# EAGLE design supply_switch (EAGLE 7.1.0)
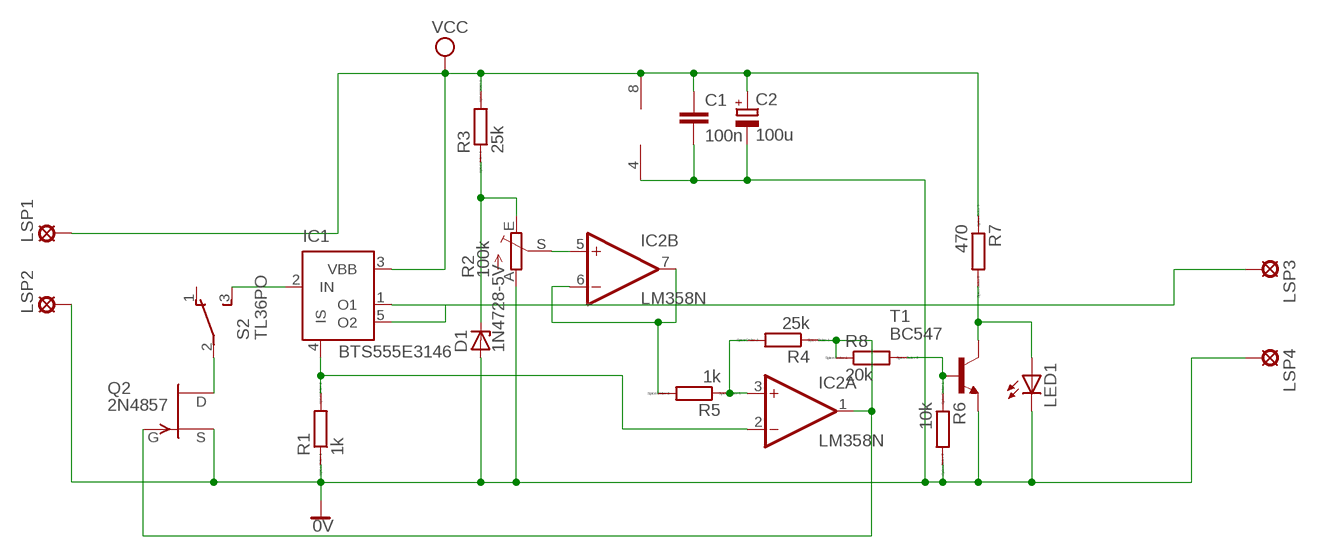
[diagram p0: schematic, sheet 1]

## Parts
C1  100n  C-EU025-030X050  [C025-030X050]
C2  100u  CPOL-EUE3.5-10  [E3,5-10]
D1  1N4728-5V  1N4728  [DO41Z10]
IC1  BTS555E3146  [TO220-52]
IC2  LM358N  [DIL08]
LED1  LED5MM  [LED5MM]
LSP1  SE14  [SE14]
LSP2  SE14  [SE14]
LSP3  SE14  [SE14]
LSP4  SE14  [SE14]
Q2  2N4857  [TO18]
R1  1k  R-EU_0207_15  [0207/15]
R2  100k  TRIM_EU-CA6H  [CA6H]
R3  25k  R-EU_0207_15  [0207/15]
R4  25k  R-EU_0207_15  [0207/15]
R5  1k  R-EU_0207_15  [0207/15]
R6  10k  R-EU_0207_15  [0207/15]
R7  470  R-EU_0207_15  [0207/15]
R8  20k  R-EU_0207_15  [0207/15]
S2  TL36PO  [TL3XPO]
T1  BC547  [TO92]

## Nets
0V: C1.2 C2.- D1.A IC2.4(P:V-) LED1.K(C) LSP2.MP LSP4.MP Q2.1(S) R1.1 R2.A R6.2 T1.1(E)
N$1: IC1.1(O1) IC1.5(O2) LSP3.MP
N$2: Q2.2(D) S2.2(P)
N$3: IC1.2(IN) S2.3(S)
N$4: IC2.6(B:-IN) IC2.7(B:OUT) R5.2
N$5: IC2.5(B:+IN) R2.S
N$6: D1.C R2.E R3.1
N$7: R6.1 R8.2 T1.2(B)
N$9: IC2.3(A:+IN) R4.2 R5.1
N$10: IC2.1(A:OUT) Q2.3(G) R4.1 R8.1
N$11: IC1.4(IS) IC2.2(A:-IN) R1.2
N$13: LED1.A R7.2 T1.3(C)
VCC: C1.1 C2.+ IC1.3(VBB) IC2.8(P:V+) LSP1.MP R3.2 R7.1
Unconnected: S2.1(O)

## Library data of the parts
C1 = rcl:C-EU: CAPACITOR, European symbol
C2 = rcl:CPOL-EU: POLARIZED CAPACITOR, European symbol
D1 = diode:1N4728: Z DIODE 3.3 V, 1W, 5 percent
IC1 = infineon:BTS555: PROFET® Data Sheet BTS555 Source: http://www.infineon.com/upload/Document/cmc_upload/documents/011/8726/Datasheet_BTS555.pdf; OC_FARNELL: unknown; OC_NEWARK: unknown
IC2 = linear:LM358: OP AMP also LM158; LM258; LM2904 Source: http://cache.national.com/ds/LM/LM158.pdf
LED1 = led:LED: LED OSRAM: - CHIPLED LG R971, LG N971, LY N971, LG Q971, LY Q971, LO R971, LY R971 LH N974, LH R974 LS Q976, LO Q976, LY Q976 LO Q996 - Hyper CHIPLED LW Q18S LB Q993, LB Q99A, LB R99A - SideLED LS A670, LO A670, LY A670, LG A670, LP A670 LB A673, LV A673, LT A673, LW A673 LH A674 LY A675 LS A676, LA A676, LO A676, LY A676, LW A676 LS A679, LY A679, LG A679 - Hyper Micro SIDELED® LS Y876, LA Y876, LO Y876, LY Y876 LT Y87S - SmartLED LW L88C, LW L88S LB L89C, LB L89S, LG L890 LS L89K, LO L89K, LY L89K LS L896, LA L896, LO L896, LY L896 - TOPLED LS T670, LO T670, LY T670, LG T670, LP T670 LSG T670, LSP T670, LSY T670, LOP T670, LYG T670 LG T671, LOG T671, LSG T671 LB T673, LV T673, LT T673, LW T673 LH T674 LS T676, LA T676, LO T676, LY T676, LB T676, LH T676, LSB T676, LW T676 LB T67C, LV T67C, LT T67C, LS T67K, LO T67K, LY T67K, LW E67C LS E67B, LA E67B, LO E67B, LY E67B, LB E67C, LV E67C, LT E67C LW T67C LS T679, LY T679, LG T679 LS T770, LO T770, LY T770, LG T770, LP T770 LB T773, LV T773, LT T773, LW T773 LH T774 LS E675, LA E675, LY E675, LS T675 LS T776, LA T776, LO T776, LY T776, LB T776 LHGB T686 LT T68C, LB T68C - Hyper Mini TOPLED® LB M676 - Mini TOPLED Santana® LG M470 LS M47K, LO M47K, LY M47K Source: http://www.osram.convergy.de LUXEON: - LUMILED® LXK2-PW12-R00, LXK2-PW12-S00, LXK2-PW14-U00, LXK2-PW14-V00 LXK2-PM12-R00, LXK2-PM12-S00, LXK2-PM14-U00 LXK2-PE12-Q00, LXK2-PE12-R00, LXK2-PE12-S00, LXK2-PE14-T00, LXK2-PE14-U00 LXK2-PB12-K00, LXK2-PB12-L00, LXK2-PB12-M00, LXK2-PB14-N00, LXK2-PB14-P00, LXK2-PB14-Q00 LXK2-PR12-L00, LXK2-PR12-M00, LXK2-PR14-Q00, LXK2-PR14-R00 LXK2-PD12-Q00, LXK2-PD12-R00, LXK2-PD12-S00 LXK2-PH12-R00, LXK2-PH12-S00 LXK2-PL12-P00, LXK2-PL12-Q00, LXK2-PL12-R00 Source: www.luxeon.com KINGBRIGHT: KA-3528ASYC Source: www.kingbright.com
LSP1-LSP4 = solpad:SE14: SOLDER PAD E1553, drill 1,4mm, distributor Buerklin, 07F820
Q2 = transistor-fet:2N4857: N-Channel Junction FET
R1 R3-R8 = resistor:R-EU_: RESISTOR, European symbol; SPICEPREFIX: R
R2 = pot:TRIM_EU-: POTENTIOMETER
S2 = switch:TL36PO: TINY SWITCH ON - ON Source: http://www2.produktinfo.conrad.com/datenblaetter/700000-724999/705152-da-01-de-Subminiaturschalter_TL_36YO.pdf
T1 = transistor:BC547: NPN TRANSISTOR

## Board
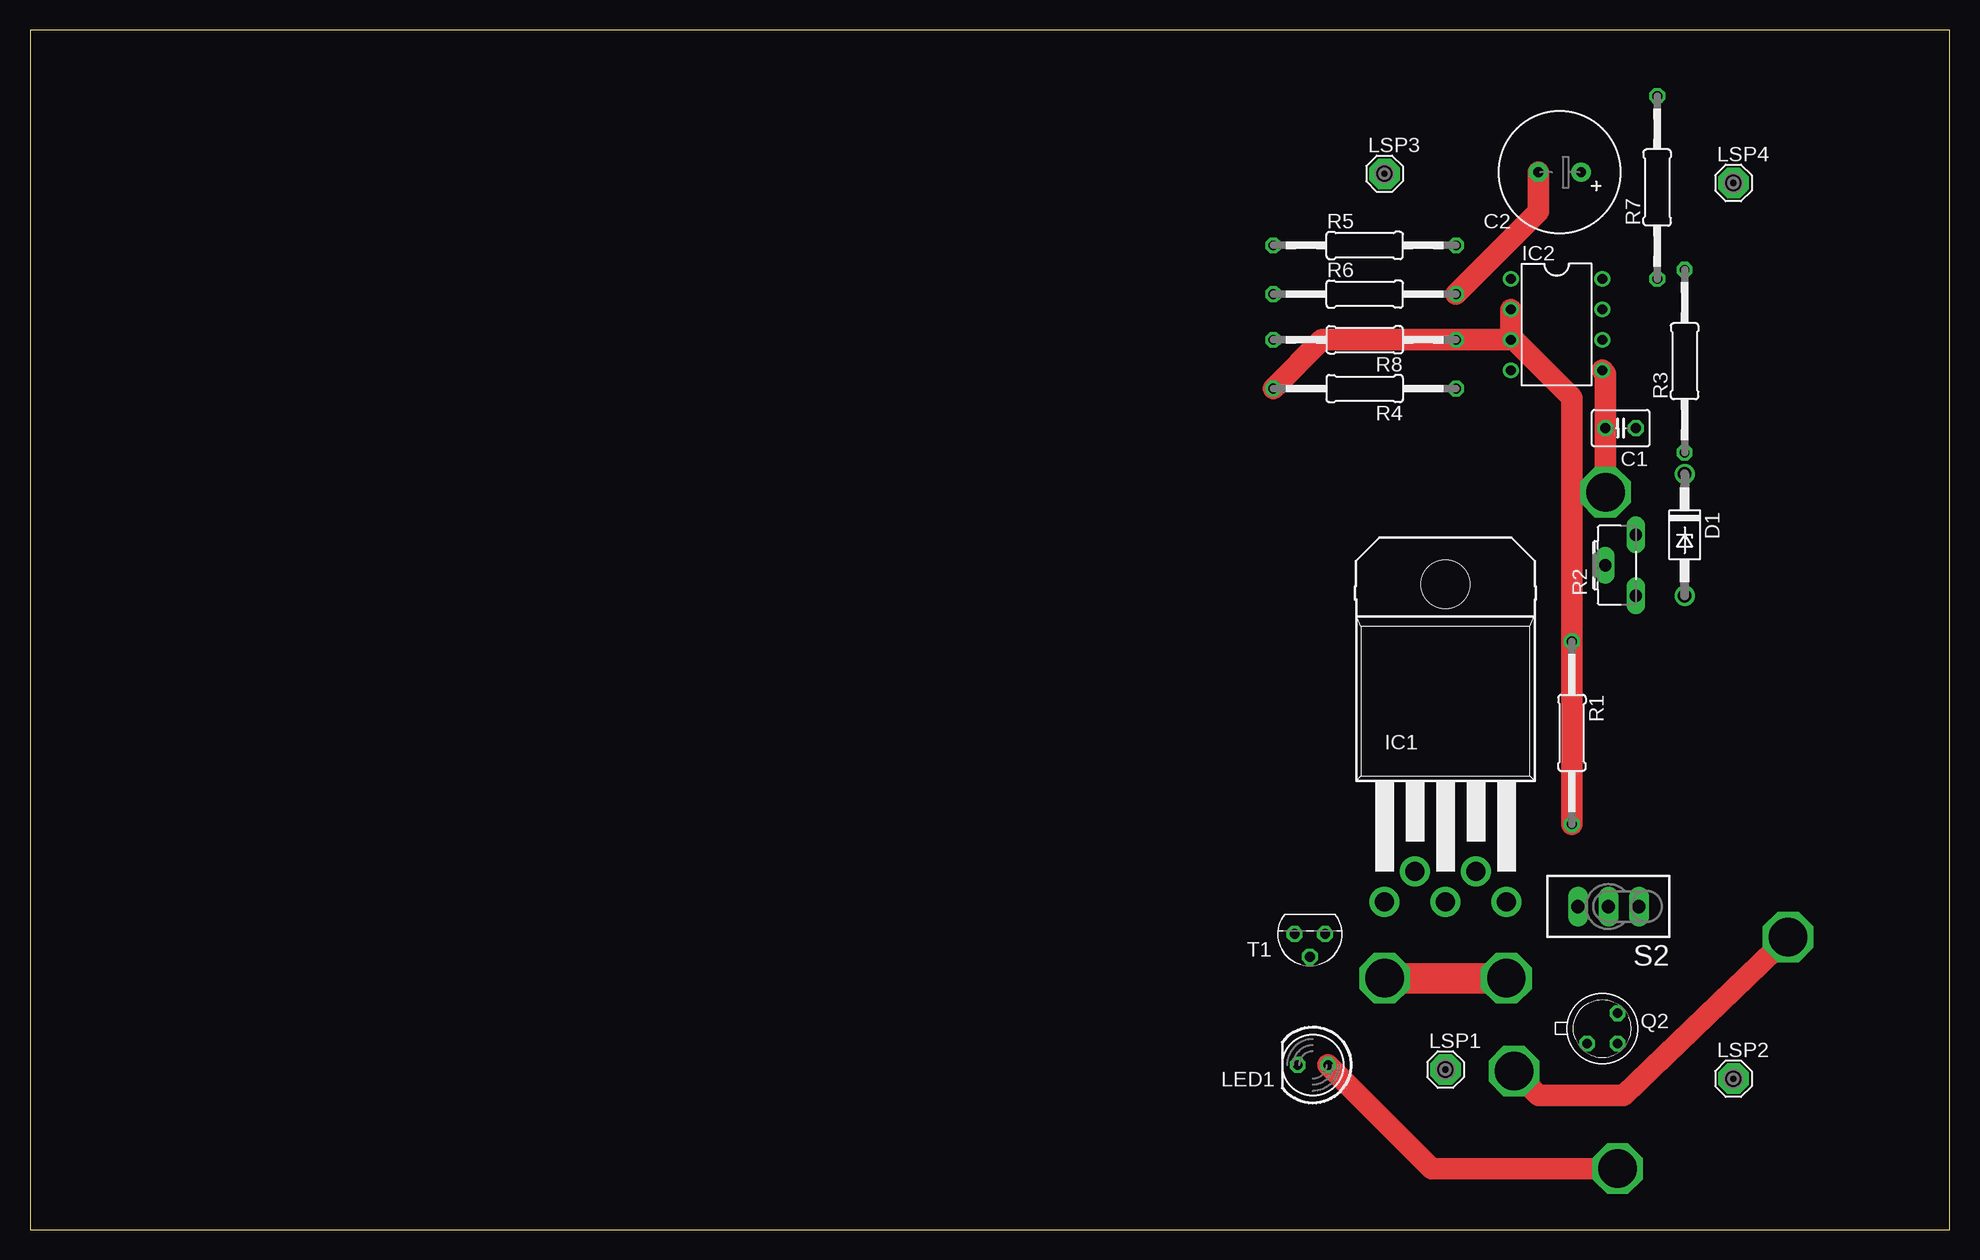
[diagram p1: board, top side]
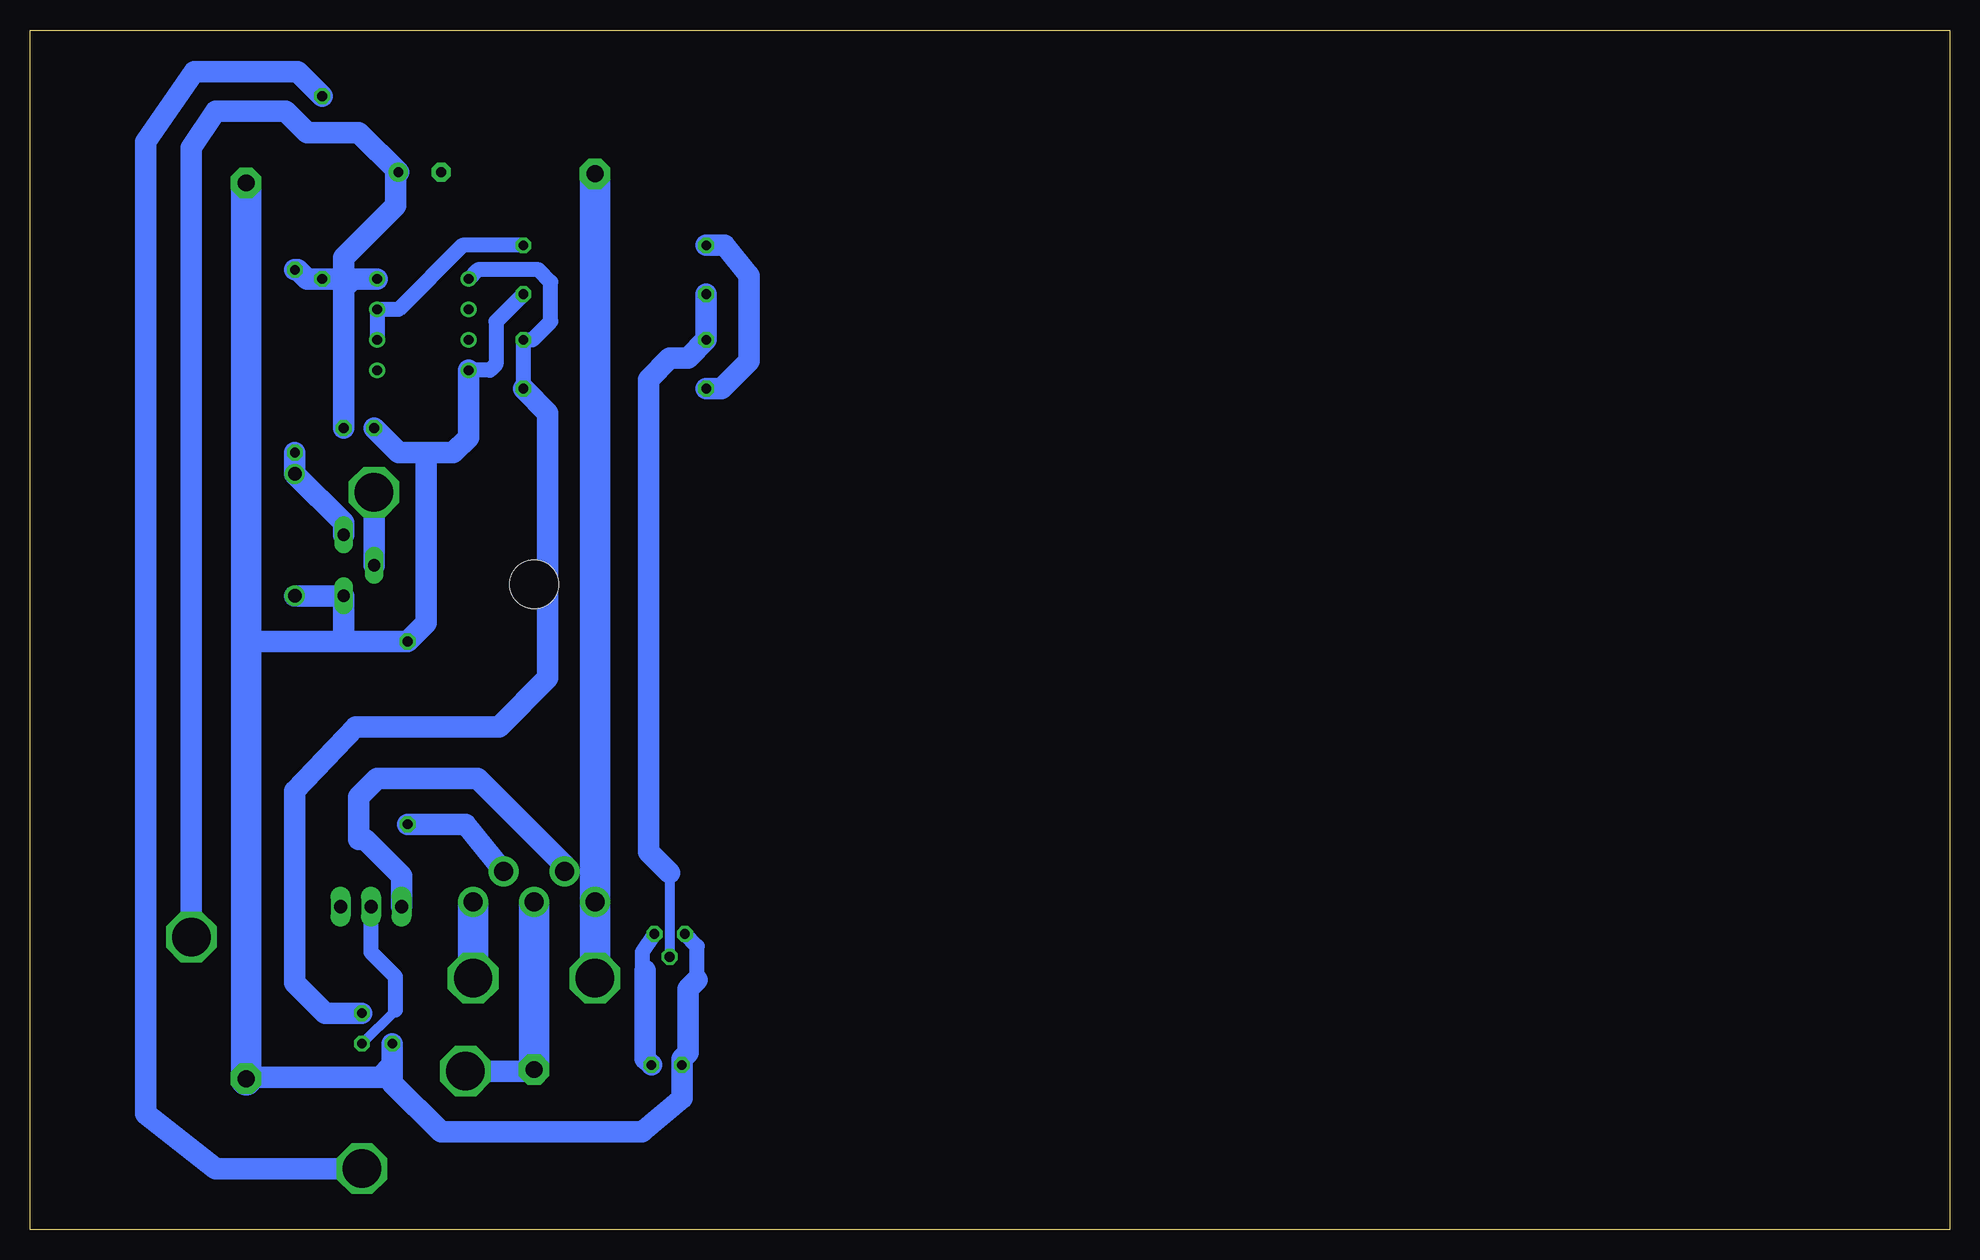
[diagram p2: board, bottom side, seen from below]

Size 160 x 100 mm. Coordinates in mm from the lower left corner, seen from the top.
Outline: 0,0 160,0 160,100 0,100 0,0
Copper layers (1*16): Top 0.035mm / dielectric 1.5mm / Bottom 0.035mm
Design rules "default": minimum track width 10mil, minimum drill 24mil, track to track 8mil, track to pad 8mil, pad to pad 8mil, via to via 8mil, smd to smd 8mil, copper to edge 40mil, drill to drill 8mil, minimum pad ring 10mil, minimum via ring 8mil, stop-mask expansion 4mil, vias tented up to drill 0mil, thermal gap 10mil
tKeepout: area 107.2,34 to 126.2,67.1

### Footprints (pad centres in the part's own frame; a part is rotated, then mirrored left to right if it is on the bottom)
C025-030X050 = drill 0.813 octagon: 1 -1.27,0; 2 1.27,0
E3,5-10 = drill 0.813 pad 1.6: + -1.778,0 | drill 0.813 pad 1.6 octagon: - 1.778,0
DO41Z10 = drill 1.118: A 5.08,0; C -5.08,0
TO220-52 = drill 1.6 pad 2.5: 1 -5.08,-30.48; 2 -2.54,-27.94; 3 0,-30.48; 4 2.54,-27.94; 5 5.08,-30.48 | hole 4.05: 0,-4
DIL08 = drill 0.813 pad 1.27: 1 -3.81,-3.81; 2 -1.27,-3.81; 3 1.27,-3.81; 4 3.81,-3.81; 5 3.81,3.81; 6 1.27,3.81; 7 -1.27,3.81; 8 -3.81,3.81
LED5MM = drill 0.813 octagon: A -1.27,0; K 1.27,0
SE14 = drill 1.397 pad 2.54 octagon: MP 0,0
TO18 = drill 0.813 octagon: 1 -1.27,-1.27; 2 1.27,-1.27; 3 1.27,1.27
0207/15 = drill 0.813 octagon: 1 -7.62,0; 2 7.62,0
CA6H = drill 1.016 long: A -2.54,0; E 2.54,0; S 0,2.54
TL3XPO = drill 1.1 pad 1.422 long: 1 -2.54,0; 2 0,0; 3 2.54,0
TO92 = drill 0.813 octagon: 1 1.27,0; 2 0,1.905; 3 -1.27,0

### Placement (x,y rotation side)
C1  132.59,66.8 180 top
C2  127.51,88.14 180 top
D1  137.92,57.91 270 top
IC1  117.98,57.78 0 top
IC2  127.25,75.44 270 top
LED1  106.93,13.72 180 top
LSP1  117.98,13.34 0 top
LSP2  141.99,12.57 0 top
LSP3  112.9,88.01 0 top
LSP4  141.99,87.25 0 top
Q2  131.06,16.76 0 top
R1  128.52,41.4 270 top
R2  133.86,55.37 90 top
R3  137.92,72.39 90 top
R4  111.25,70.1 180 top
R5  111.25,82.04 0 top
R6  111.25,77.98 0 top
R7  135.64,86.87 90 top
R8  111.25,74.17 180 top
S2  131.57,26.92 180 top
T1  106.68,24.64 180 top

### Tracks (layer width: path | path; a pad name or v marks a point on that pad's centre or on a via)
0V
  Top 1.778: C2.- 125.73,84.84 R6.2
  Bottom 1.27: R6.2 121.16,75.69 121.16,72.14 121.67,71.63 IC2.4 | 104.39,20.83 104.39,23.62 T1.1
  Bottom 1.778: 134.11,49.02 R1.1 127,50.55 127,64.77 | 134.11,49.02 141.99,49.02 | 134.11,49.02 133.86,49.28 R2.A D1.A | C1.2 129.29,64.77 127,64.77 | 127,64.77 124.71,64.77 123.44,66.04 IC2.4 | Q2.1 129.79,13.72 | 129.79,13.72 130.81,12.7 141.73,12.7 141.99,12.45 | 129.79,13.72 129.79,12.19 125.73,8.13 108.97,8.13 105.66,10.92 LED1.K 105.66,14.22 105.16,14.73 105.16,20.07 104.39,20.83
  Bottom 2.54: 141.99,12.45 LSP2.MP 141.99,49.02 LSP4.MP
N$1  (via drill 3.2 pad 1.27)
  Top 2.54: v123.06,20.95 v112.9,20.95
  Bottom 2.54: LSP3.MP IC1.1 v112.9,20.95 | IC1.5 v123.06,20.95
N$2
  Bottom 0.813: Q2.2 129.54,18.29
  Bottom 1.27: 129.54,18.29 129.54,21.08 131.57,23.11 S2.2
N$3
  Bottom 1.778: S2.3 129.03,29.46 132.08,32.51 132.59,32.51 132.59,36.07 131.06,37.59 122.68,37.59 115.44,30.35 IC1.2
N$4
  Bottom 1.27: R5.2 123.95,82.04 129.29,76.71 IC2.7 IC2.6
N$5  (via drill 3.2 pad 0.81)
  Top 1.778: v131.32,61.47 131.32,71.37 IC2.5
  Bottom 1.778: R2.S v131.32,61.47
N$6
  Bottom 1.778: R2.E 133.86,58.93 D1.C R3.1
N$7
  Bottom 0.813: 106.68,29.72 T1.2
  Bottom 1.778: R6.1 R8.2 105.16,72.64 106.68,72.64 108.46,70.87 108.46,31.5 106.68,29.72
N$9
  Top 1.778: IC2.3 107.7,74.17 R4.2
  Bottom 1.778: R5.1 102.11,82.04 100.08,79.5 100.08,72.39 102.36,70.1 R4.2
N$10
  Bottom 1.27: IC2.1 122.68,80.01 117.6,80.01 116.59,78.99 116.59,75.69 118.11,74.17 R8.1 R4.1
  Bottom 1.778: Q2.3 135.38,18.03 137.92,20.57 137.92,36.58 132.84,41.91 120.9,41.91 116.84,45.97 116.84,68.07 R4.1
N$11
  Top 1.778: IC2.2 123.44,74.42 128.52,69.34 R1.2
  Bottom 1.778: R1.2 123.7,33.78 IC1.4
N$13  (via drill 3.2 pad 1.27)
  Top 1.778: v132.33,5.08 116.84,5.08 LED1.A
  Bottom 1.27: T1.3 108.97,23.11 108.97,21.84 108.71,21.59
  Bottom 1.778: 108.71,21.59 108.71,14.22 LED1.A | R7.2 137.67,96.52 146.3,96.52 150.37,90.68 150.37,9.65 144.53,5.08 v132.33,5.08
VCC  (via drill 3.2 pad 1.02, 3.2 pad 1.27)
  Top 1.778: v123.7,13.21 125.73,11.18 132.84,11.18 v146.56,24.38
  Bottom 1.778: C1.1 133.86,78.49 133.22,79.12 | 133.22,79.12 133.1,79.25 IC2.8 | R3.2 137.67,80.01 136.91,79.25 R7.1 133.86,79.25 | 133.86,79.25 133.35,79.25 133.22,79.12 | 133.86,79.25 133.86,81.03 129.54,85.34 129.54,87.88 C2.+ 132.59,91.44 136.91,91.44 138.68,93.22 144.53,93.22 146.56,90.17 v146.56,24.38 | LSP1.MP 118.11,13.21 v123.7,13.21
  Bottom 2.54: IC1.3 LSP1.MP